# EAGLE design MPL3115_breakout (EAGLE 7.4.0)
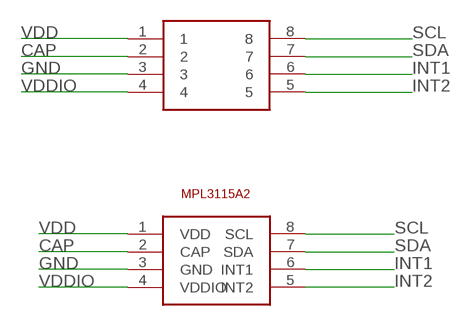
[diagram p0: schematic, sheet 1]

## Parts
MPL3115A1  FS-MPL3115A2  [FREESCALE-MPL3115A2]
U$1  8PIN  [8PIN]

## Nets
CAP: MPL3115A1.2(CAP) U$1.2
GND: MPL3115A1.3(GND) U$1.3
INT1: MPL3115A1.6(INT1) U$1.6
INT2: MPL3115A1.5(INT2) U$1.5
SCL: MPL3115A1.8(SCL) U$1.8
SDA: MPL3115A1.7(SDA) U$1.7
VDD: MPL3115A1.1(VDD) U$1.1
VDDIO: MPL3115A1.4(VDDIO) U$1.4

## Library data of the parts
MPL3115A1 = FaBo-Mems:FS-MPL3115A2
U$1 = FaBo-Breakout:8PIN

## Board
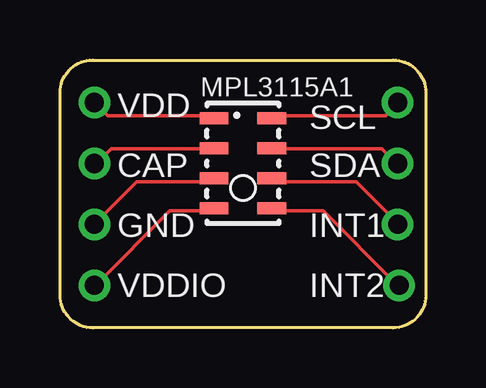
[diagram p1: board, top side]

Size 15.24 x 11.16 mm. Coordinates in mm from the lower left corner, seen from the top.
Copper layers (1*16): Top 0.035mm / dielectric 1.5mm / Bottom 0.035mm
Design rules "SeeedStudio_2layer_DRU_no_angle_20140221": minimum track width 6mil, minimum drill 12mil, track to track 6mil, track to pad 6mil, pad to pad 6mil, via to via 6mil, smd to smd 0mil, copper to edge 10mil, drill to drill 10mil, minimum pad ring 10mil, minimum via ring 6mil, stop-mask expansion 2mil, vias tented up to drill 100mil, thermal gap 10mil

### Footprints (pad centres in the part's own frame; a part is rotated, then mirrored left to right if it is on the bottom)
FREESCALE-MPL3115A2 = smd 1.2 x 0.5: 1 -1.2,1.875; 2 -1.2,0.625; 3 -1.2,-0.625; 4 -1.2,-1.875; 5 1.2,-1.875; 6 1.2,-0.625; 7 1.2,0.625; 8 1.2,1.875
8PIN = drill 0.8: 1 -7.46,3.81; 2 -7.46,1.27; 3 -7.46,-1.27; 4 -7.46,-3.81; 5 5.24,-3.81; 6 5.18,-1.27; 7 5.18,1.27; 8 5.18,3.81

### Placement (x,y rotation side)
MPL3115A1  7.62,6.85 0 top
U$1  8.89,5.58 0 top

### Tracks (layer width: path | path; a pad name or v marks a point on that pad's centre or on a via)
CAP
  Top 0.152: MPL3115A1.2 6.4,7.46 2.13,7.46 1.52,6.85 U$1.2
GND
  Top 0.152: MPL3115A1.3 6.4,6.09 3.2,6.09 1.52,4.41 U$1.3
INT1
  Top 0.152: MPL3115A1.6 8.84,6.09 12.34,6.09 14.02,4.41 U$1.6
INT2
  Top 0.152: MPL3115A1.5 8.84,4.87 10.97,4.87 14.02,1.82 U$1.5
SCL
  Top 0.152: MPL3115A1.8 8.84,8.83 13.56,8.83 14.02,9.29 U$1.8
SDA
  Top 0.152: MPL3115A1.7 8.84,7.46 13.41,7.46 14.02,6.85 U$1.7
VDD
  Top 0.152: MPL3115A1.1 6.4,8.83 1.98,8.83 1.52,9.29 U$1.1
VDDIO
  Top 0.152: MPL3115A1.4 6.4,4.87 4.57,4.87 1.52,1.82 U$1.4

### Text on the board
tPlace: VDD | SCL | CAP | SDA | GND | INT1 | VDDIO | INT2